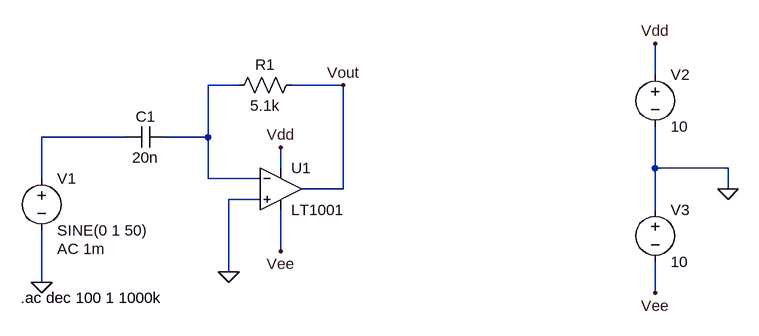
[diagram p0: schematic EJ3-a.asc]
EJ3-a.asc, the LTspice schematic file:
Version 4
SHEET 1 996 680
WIRE 864 80 864 32
WIRE 224 96 176 96
WIRE 384 96 304 96
WIRE 48 176 -80 176
WIRE 176 176 176 96
WIRE 176 176 112 176
WIRE 288 224 288 192
WIRE 864 224 864 160
WIRE 976 224 864 224
WIRE -80 240 -80 176
WIRE 176 240 176 176
WIRE 256 240 176 240
WIRE 384 256 384 96
WIRE 384 256 320 256
WIRE 976 256 976 224
WIRE 256 272 208 272
WIRE 864 288 864 224
WIRE 288 352 288 288
WIRE 208 384 208 272
WIRE -80 400 -80 320
WIRE 864 416 864 368
FLAG -80 400 0
FLAG 208 384 0
FLAG 384 96 Vout
FLAG 976 256 0
FLAG 288 192 Vdd
FLAG 288 352 Vee
FLAG 864 32 Vdd
FLAG 864 416 Vee
SYMBOL cap 112 160 R90
WINDOW 0 0 32 VBottom 2
WINDOW 3 32 32 VTop 2
SYMATTR InstName C1
SYMATTR Value 20n
SYMBOL res 320 80 R90
WINDOW 0 0 56 VBottom 2
WINDOW 3 32 56 VTop 2
SYMATTR InstName R1
SYMATTR Value 5.1k
SYMBOL voltage -80 224 R0
WINDOW 123 24 124 Left 2
WINDOW 39 0 0 Left 0
SYMATTR Value2 AC 1m
SYMATTR InstName V1
SYMATTR Value SINE(0 1 50)
SYMBOL OpAmps\\LT1001 288 192 R0
SYMATTR InstName U1
SYMBOL voltage 864 64 R0
WINDOW 123 0 0 Left 0
WINDOW 39 0 0 Left 0
SYMATTR InstName V2
SYMATTR Value 10
SYMBOL voltage 864 272 R0
WINDOW 123 0 0 Left 0
WINDOW 39 0 0 Left 0
SYMATTR InstName V3
SYMATTR Value 10
TEXT -112 424 Left 2 !.ac dec 100 1 1000k

The netlist it stands for:
* EJ3-a.asc
C1 N001 N002 20n
R1 Vout N001 5.1k
V1 N002 0 SINE(0 1 50) AC 1m
XU1 0 N001 Vdd Vee Vout LT1001  ; pins In+ In- V+ V- OUT
V2 Vdd 0 10
V3 0 Vee 10
.ac dec 100 1 1000k
.lib LTC.lib
.backanno
.end